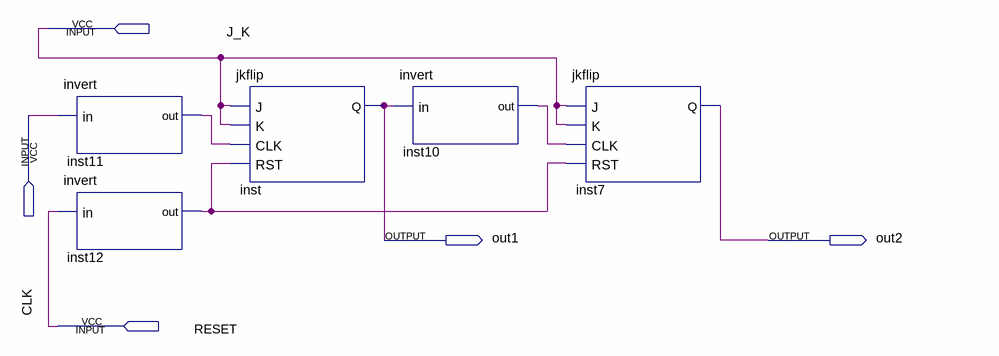
[diagram p0: schematic sheet]
// Quartus schematic mod3.bdf as structural Verilog: 5 symbols, 5 pins
module mod3 (
  input  J_K,
  input  CLK,
  input  RESET,
  output out1,
  output out2
);

  wire inst10_out, inst11_out, inst12_out;

  invert inst11 (.in(CLK), .out(inst11_out));
  invert inst12 (.in(RESET), .out(inst12_out));
  jkflip inst (.J(J_K), .K(J_K), .CLK(inst11_out), .RST(inst12_out), .Q(out1));
  invert inst10 (.in(out1), .out(inst10_out));
  jkflip inst7 (.J(J_K), .K(J_K), .CLK(inst10_out), .RST(inst12_out), .Q(out2));
endmodule
